# EAGLE schematic solenoidcontroller (EAGLE 7.1.0)
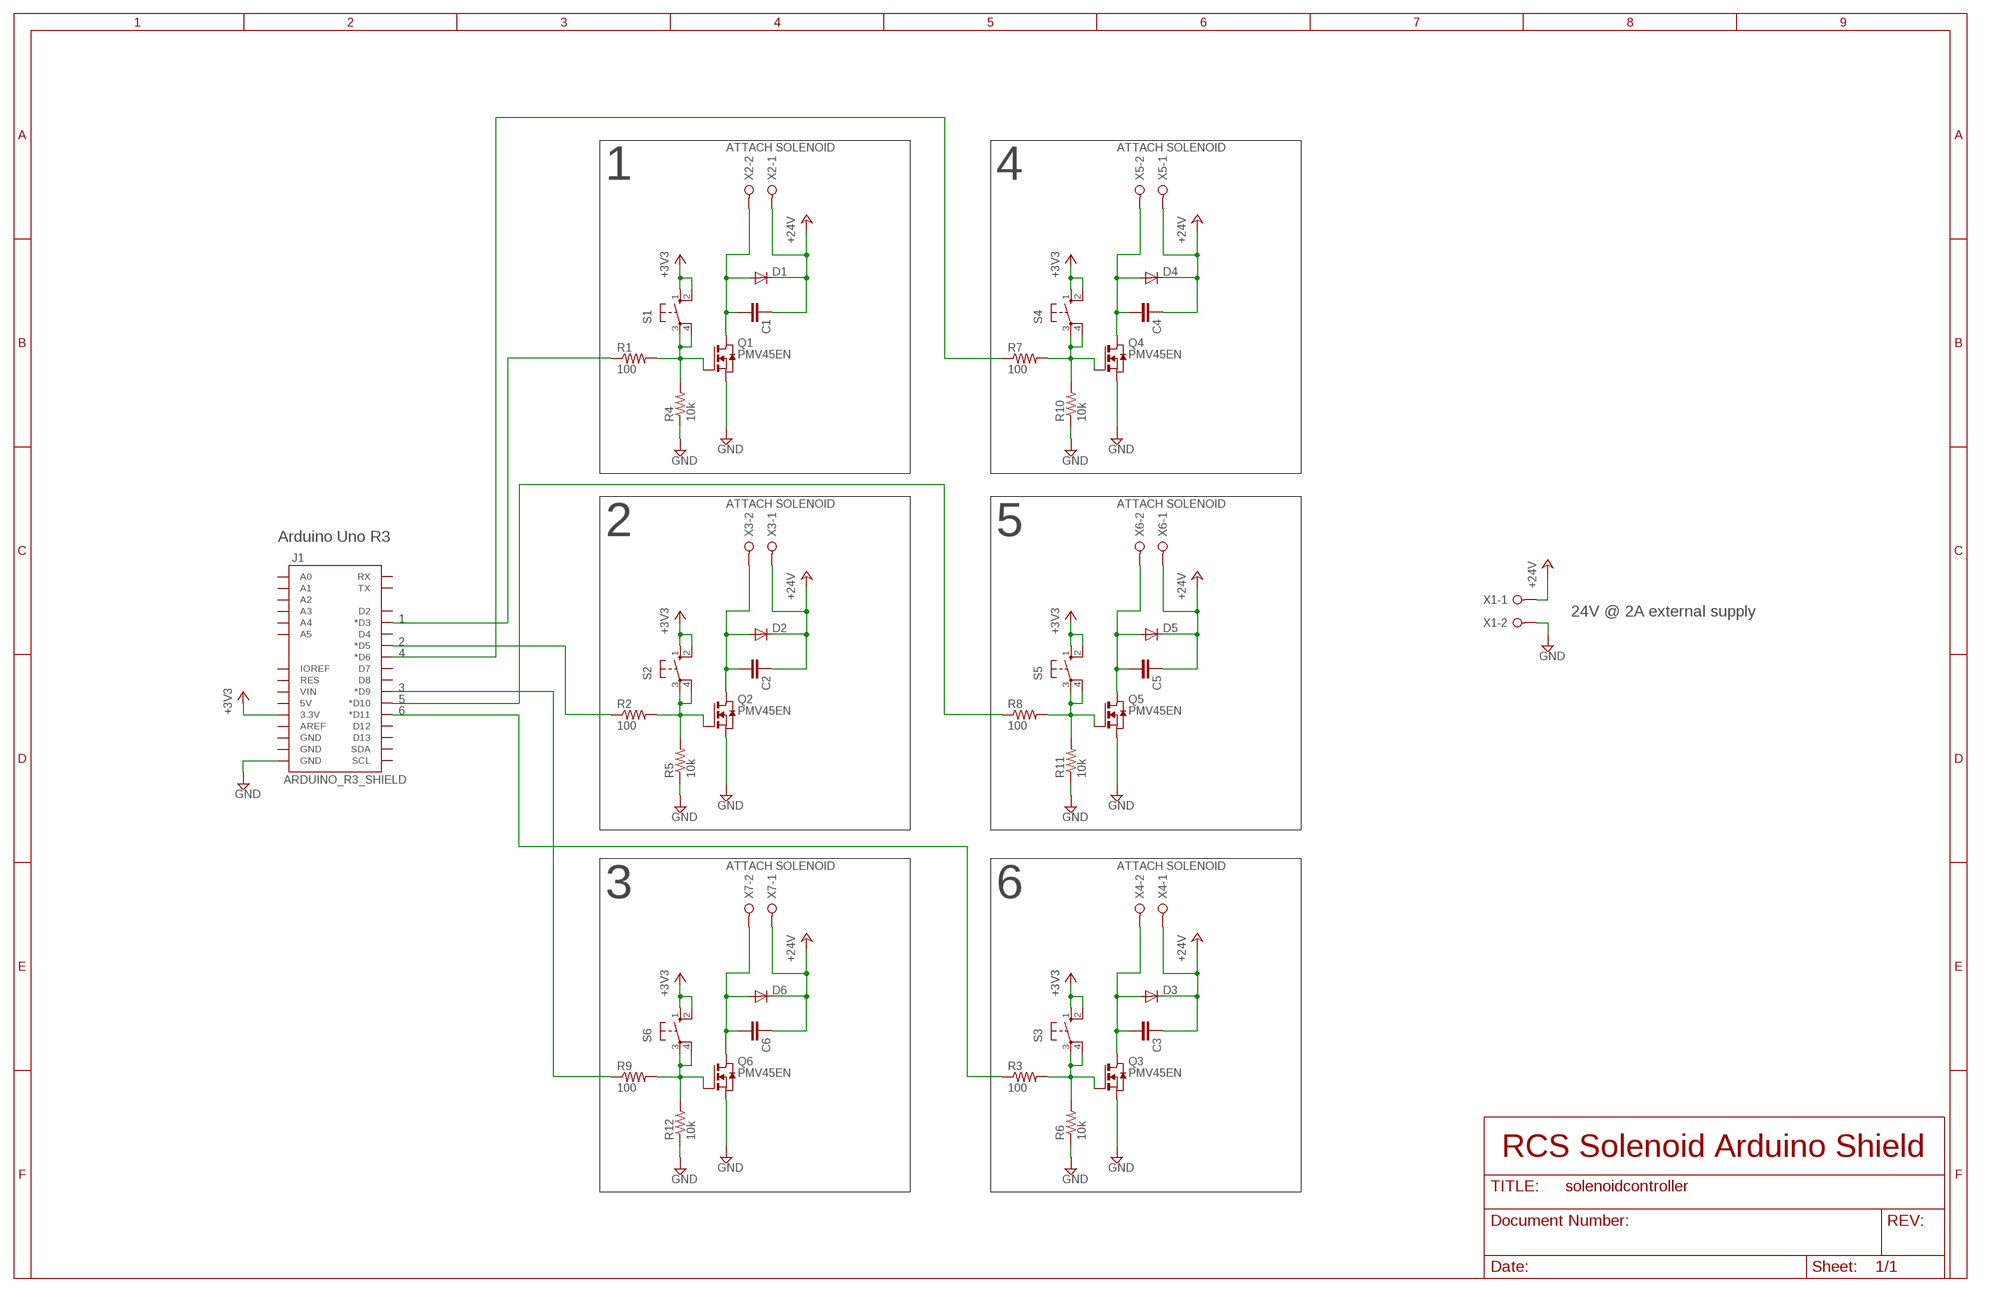
[diagram p0: schematic, sheet 1]

## Parts
C1  C-EUC0603  [C0603]
C2  C-EUC0603  [C0603]
C3  C-EUC0603  [C0603]
C4  C-EUC0603  [C0603]
C5  C-EUC0603  [C0603]
C6  C-EUC0603  [C0603]
D1  DIODE-DO214BA  [DO214BA]
D2  DIODE-DO214BA  [DO214BA]
D3  DIODE-DO214BA  [DO214BA]
D4  DIODE-DO214BA  [DO214BA]
D5  DIODE-DO214BA  [DO214BA]
D6  DIODE-DO214BA  [DO214BA]
J1  ARDUINO_R3_SHIELD  [UNO_R3_SHIELD]
Q1  PMV45EN  [SOT23]
Q2  PMV45EN  [SOT23]
Q3  PMV45EN  [SOT23]
Q4  PMV45EN  [SOT23]
Q5  PMV45EN  [SOT23]
Q6  PMV45EN  [SOT23]
R1  100  R-US_R0603  [R0603]
R2  100  R-US_R0603  [R0603]
R3  100  R-US_R0603  [R0603]
R4  10k  R-US_R0603  [R0603]
R5  10k  R-US_R0603  [R0603]
R6  10k  R-US_R0603  [R0603]
R7  100  R-US_R0603  [R0603]
R8  100  R-US_R0603  [R0603]
R9  100  R-US_R0603  [R0603]
R10  10k  R-US_R0603  [R0603]
R11  10k  R-US_R0603  [R0603]
R12  10k  R-US_R0603  [R0603]
S1  10-XX  [B3F-10XX]
S2  10-XX  [B3F-10XX]
S3  10-XX  [B3F-10XX]
S4  10-XX  [B3F-10XX]
S5  10-XX  [B3F-10XX]
S6  10-XX  [B3F-10XX]
X1  W237-02P  [W237-132]
X2  W237-02P  [W237-132]
X3  W237-02P  [W237-132]
X4  W237-02P  [W237-132]
X5  W237-02P  [W237-132]
X6  W237-02P  [W237-132]
X7  W237-02P  [W237-132]

## Nets
1: J1.D3(*D3) R1.1
2: J1.D5(*D5) R2.1
3: J1.D9(*D9) R9.1
4: J1.D6(*D6) R7.1
5: J1.D10(*D10) R8.1
6: J1.D11(*D11) R3.1
+3V3: J1.3.3V S1.1(S) S1.2(S1) S2.1(S) S2.2(S1) S3.1(S) S3.2(S1) S4.1(S) S4.2(S1) S5.1(S) S5.2(S1) S6.1(S) S6.2(S1)
+24V: C1.1 C2.1 C3.1 C4.1 C5.1 C6.1 D1.C D2.C D3.C D4.C D5.C D6.C X1.1 X2.1 X3.1 X4.1 X5.1 X6.1 X7.1
GND: J1.GND@0(GND) Q1.2(S) Q2.2(S) Q3.2(S) Q4.2(S) Q5.2(S) Q6.2(S) R4.1 R5.1 R6.1 R10.1 R11.1 R12.1 X1.2
N$1: Q2.1(G) R2.2 R5.2 S2.3(P) S2.4(P1)
N$2: Q3.1(G) R3.2 R6.2 S3.3(P) S3.4(P1)
N$3: C2.2 D2.A Q2.3(D) X3.2
N$4: C3.2 D3.A Q3.3(D) X4.2
N$5: Q1.1(G) R1.2 R4.2 S1.3(P) S1.4(P1)
N$6: C1.2 D1.A Q1.3(D) X2.2
N$7: Q4.1(G) R7.2 R10.2 S4.3(P) S4.4(P1)
N$8: C4.2 D4.A Q4.3(D) X5.2
N$9: Q5.1(G) R8.2 R11.2 S5.3(P) S5.4(P1)
N$10: C5.2 D5.A Q5.3(D) X6.2
N$11: Q6.1(G) R9.2 R12.2 S6.3(P) S6.4(P1)
N$12: C6.2 D6.A Q6.3(D) X7.2
Unconnected: J1.5V J1.A0 J1.A1 J1.A2 J1.A3 J1.A4 J1.A5 J1.AREF J1.D2 J1.D4 J1.D7 J1.D8 J1.D12 J1.D13 J1.GND@1(GND) J1.GND@2(GND) J1.IOREF J1.RES J1.RX J1.SCL J1.SDA J1.TX J1.VIN

## Notes on the sheet
- ATTACH SOLENOID | ATTACH SOLENOID
- 1 | 4
- ATTACH SOLENOID | ATTACH SOLENOID
- 2 | 5
- Arduino Uno R3
- 24V @ 2A external supply
- ATTACH SOLENOID | ATTACH SOLENOID
- 3 | 6
- RCS Solenoid Arduino Shield

## Library data of the parts
C1-C6 = rcl:C-EU: CAPACITOR, European symbol
D1-D6 = diode:DIODE-: DIODE
J1 = SparkFun-Boards:ARDUINO_R3_SHIELD: Shield form compatible with the Arduino Uno R3.
Q1-Q6 = Q_PMV45EN_N_ch_MOSFET:PMV45EN
R1-R12 = resistor:R-US_: RESISTOR, American symbol
S1-S6 = switch-omron:10-XX: OMRON SWITCH; MPN: B3F-1000; OC_FARNELL: 176432; OC_NEWARK: 36M3542
X1-X7 = con-wago-508:W237-02P: WAGO SREW CLAMP; OC_FARNELL: unknown; OC_NEWARK: unknown